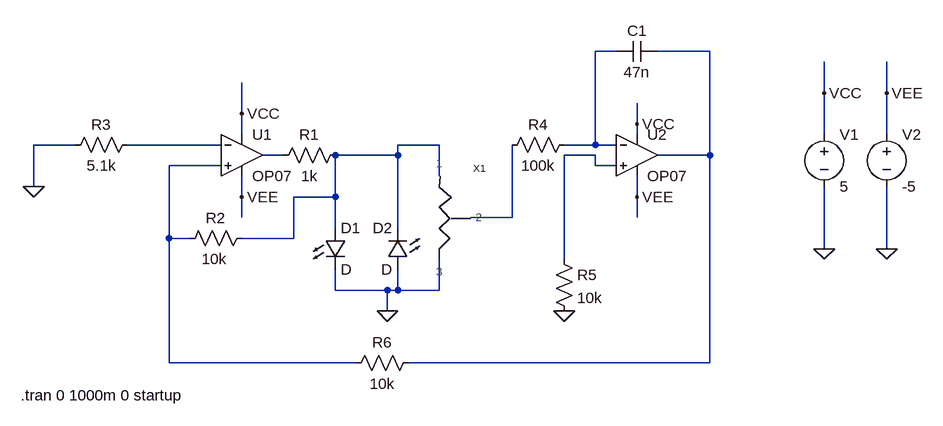
[diagram p0: schematic 1_11.asc]
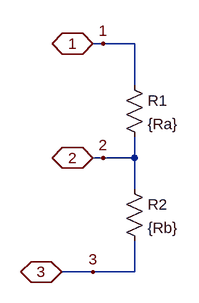
[diagram p1: sub-circuit dian_wei_qi.asc]
1_11.asc, the LTspice schematic file:
Version 4
SHEET 1 1176 680
WIRE 704 -112 672 -112
WIRE 848 -112 768 -112
WIRE 1024 -48 1024 -96
WIRE 1120 -48 1120 -96
WIRE 128 -16 128 -64
WIRE 736 0 736 -32
WIRE 128 16 128 -16
WIRE 736 16 736 0
WIRE 1024 16 1024 -48
WIRE 1120 16 1120 -48
WIRE -128 32 -192 32
WIRE 96 32 -48 32
WIRE 432 32 368 32
WIRE 672 32 672 -112
WIRE 672 32 624 32
WIRE 704 32 672 32
WIRE 192 48 160 48
WIRE 368 48 368 32
WIRE 368 48 272 48
WIRE 672 48 624 48
WIRE 848 48 848 -112
WIRE 848 48 768 48
WIRE 96 64 16 64
WIRE 672 64 672 48
WIRE 704 64 672 64
WIRE 432 80 432 32
WIRE -192 96 -192 32
WIRE 128 112 128 80
WIRE 272 112 272 48
WIRE 272 112 208 112
WIRE 736 112 736 80
WIRE 128 144 128 112
WIRE 544 144 544 32
WIRE 544 144 480 144
WIRE 736 144 736 112
WIRE 272 160 272 112
WIRE 368 160 368 48
WIRE 16 176 16 64
WIRE 48 176 16 176
WIRE 208 176 208 112
WIRE 208 176 128 176
WIRE 1024 192 1024 96
WIRE 1120 192 1120 96
WIRE 624 208 624 48
WIRE 272 256 272 224
WIRE 352 256 272 256
WIRE 368 256 368 224
WIRE 368 256 352 256
WIRE 432 256 432 208
WIRE 432 256 368 256
WIRE 352 288 352 256
WIRE 16 368 16 176
WIRE 304 368 16 368
WIRE 848 368 848 48
WIRE 848 368 384 368
FLAG 352 288 0
FLAG 624 288 0
FLAG -192 96 0
FLAG 1024 192 0
FLAG 1120 192 0
FLAG 1024 -48 VCC
FLAG 736 0 VCC
FLAG 128 -16 VCC
FLAG 1120 -48 VEE
FLAG 736 112 VEE
FLAG 128 112 VEE
SYMBOL OpAmps\\OP07 128 -16 R0
SYMATTR InstName U1
SYMBOL OpAmps\\OP07 736 -16 R0
SYMATTR InstName U2
SYMBOL LED 256 160 R0
SYMATTR InstName D1
SYMBOL res 288 32 R90
WINDOW 0 0 56 VBottom 2
WINDOW 3 32 56 VTop 2
SYMATTR InstName R1
SYMATTR Value 1k
SYMBOL res 144 160 R90
WINDOW 0 0 56 VBottom 2
WINDOW 3 32 58 VTop 2
SYMATTR InstName R2
SYMATTR Value 10k
SYMBOL res -32 16 R90
WINDOW 0 0 56 VBottom 2
WINDOW 3 32 56 VTop 2
SYMATTR InstName R3
SYMATTR Value 5.1k
SYMBOL res 640 16 R90
WINDOW 0 0 56 VBottom 2
WINDOW 3 32 56 VTop 2
SYMATTR InstName R4
SYMATTR Value 100k
SYMBOL res 608 192 R0
SYMATTR InstName R5
SYMATTR Value 10k
SYMBOL cap 768 -128 R90
WINDOW 0 0 32 VBottom 2
WINDOW 3 32 32 VTop 2
SYMATTR InstName C1
SYMATTR Value 47n
SYMBOL res 400 352 R90
WINDOW 0 0 56 VBottom 2
WINDOW 3 32 56 VTop 2
SYMATTR InstName R6
SYMATTR Value 10k
SYMBOL voltage 1024 0 R0
WINDOW 123 0 0 Left 0
WINDOW 39 0 0 Left 0
SYMATTR InstName V1
SYMATTR Value 5
SYMBOL voltage 1120 0 R0
WINDOW 123 0 0 Left 0
WINDOW 39 0 0 Left 0
SYMATTR InstName V2
SYMATTR Value -5
SYMBOL dian_wei_qi 416 144 R0
SYMATTR InstName X1
SYMATTR SpiceLine Ra=10k,Rb=1k
SYMBOL LED 384 224 R180
WINDOW 0 24 64 Left 2
WINDOW 3 24 0 Left 2
SYMATTR InstName D2
TEXT -212 418 Left 2 !.tran 0 1000m 0 startup

dian_wei_qi.asc, the sub-circuit schematic file:
Version 4
SHEET 1 880 680
WIRE 144 -32 128 -32
WIRE 192 -32 144 -32
WIRE 192 32 192 -32
WIRE 144 144 128 144
WIRE 192 144 192 112
WIRE 192 144 144 144
WIRE 192 192 192 144
WIRE 128 320 80 320
WIRE 192 320 192 272
WIRE 192 320 128 320
FLAG 144 -32 1
FLAG 144 144 2
FLAG 128 320 3
FLAG 128 -32 1
IOPIN 128 -32 BiDir
FLAG 128 144 2
IOPIN 128 144 BiDir
FLAG 80 320 3
IOPIN 80 320 BiDir
SYMBOL res 176 16 R0
SYMATTR InstName R1
SYMATTR Value {Ra}
SYMBOL res 176 176 R0
SYMATTR InstName R2
SYMATTR Value {Rb}

The netlist it stands for:
* 1_11.asc
XU1 N007 N003 VCC VEE N005 LT1001  ; OP07, pins In+ In- V+ V- OUT
XU2 N006 N001 VCC VEE N002 LT1001  ; OP07, pins In+ In- V+ V- OUT
D1 N004 0 D
R1 N004 N005 1k
R2 N004 N007 10k
R3 N003 0 5.1k
R4 N001 N008 100k
R5 N006 0 10k
C1 N002 N001 47n
R6 N002 N007 10k
V1 VCC 0 5
V2 VEE 0 -5
XX1 N004 N008 0 dian_wei_qi params: Ra=10k,Rb=1k
D2 0 N004 D

* block symbol definitions
.subckt dian_wei_qi 1 2 3
R1 1 2 {Ra}
R2 2 3 {Rb}
.ends dian_wei_qi

.model D D
.lib standard.dio
.tran 0 1000m 0 startup
.lib LTC.lib
.backanno
.end

* Results of the author's LTspice run, read from the files saved beside the schematic
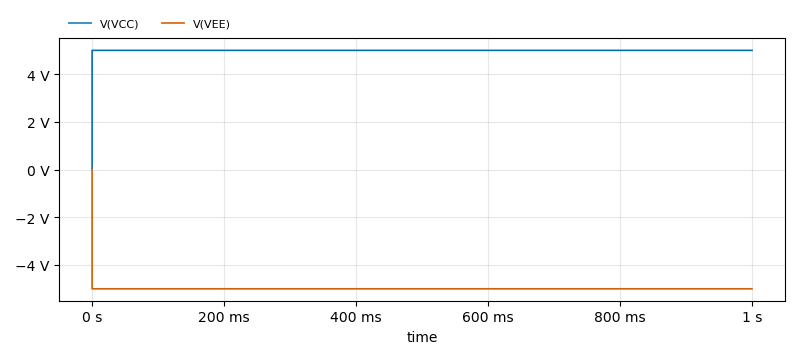
[diagram p2: Transient Analysis of 1_11.asc, plotted from the saved traces]
* Transient Analysis, 1 run:
*   V(VCC): min 0 V, max 5 V, average 5 V, rms 5 V, last 5 V
*   V(VEE): min -5 V, max 0 V, average -5 V, rms 5 V, last -5 V